# Altium project PCB_BTL.PrjPcb
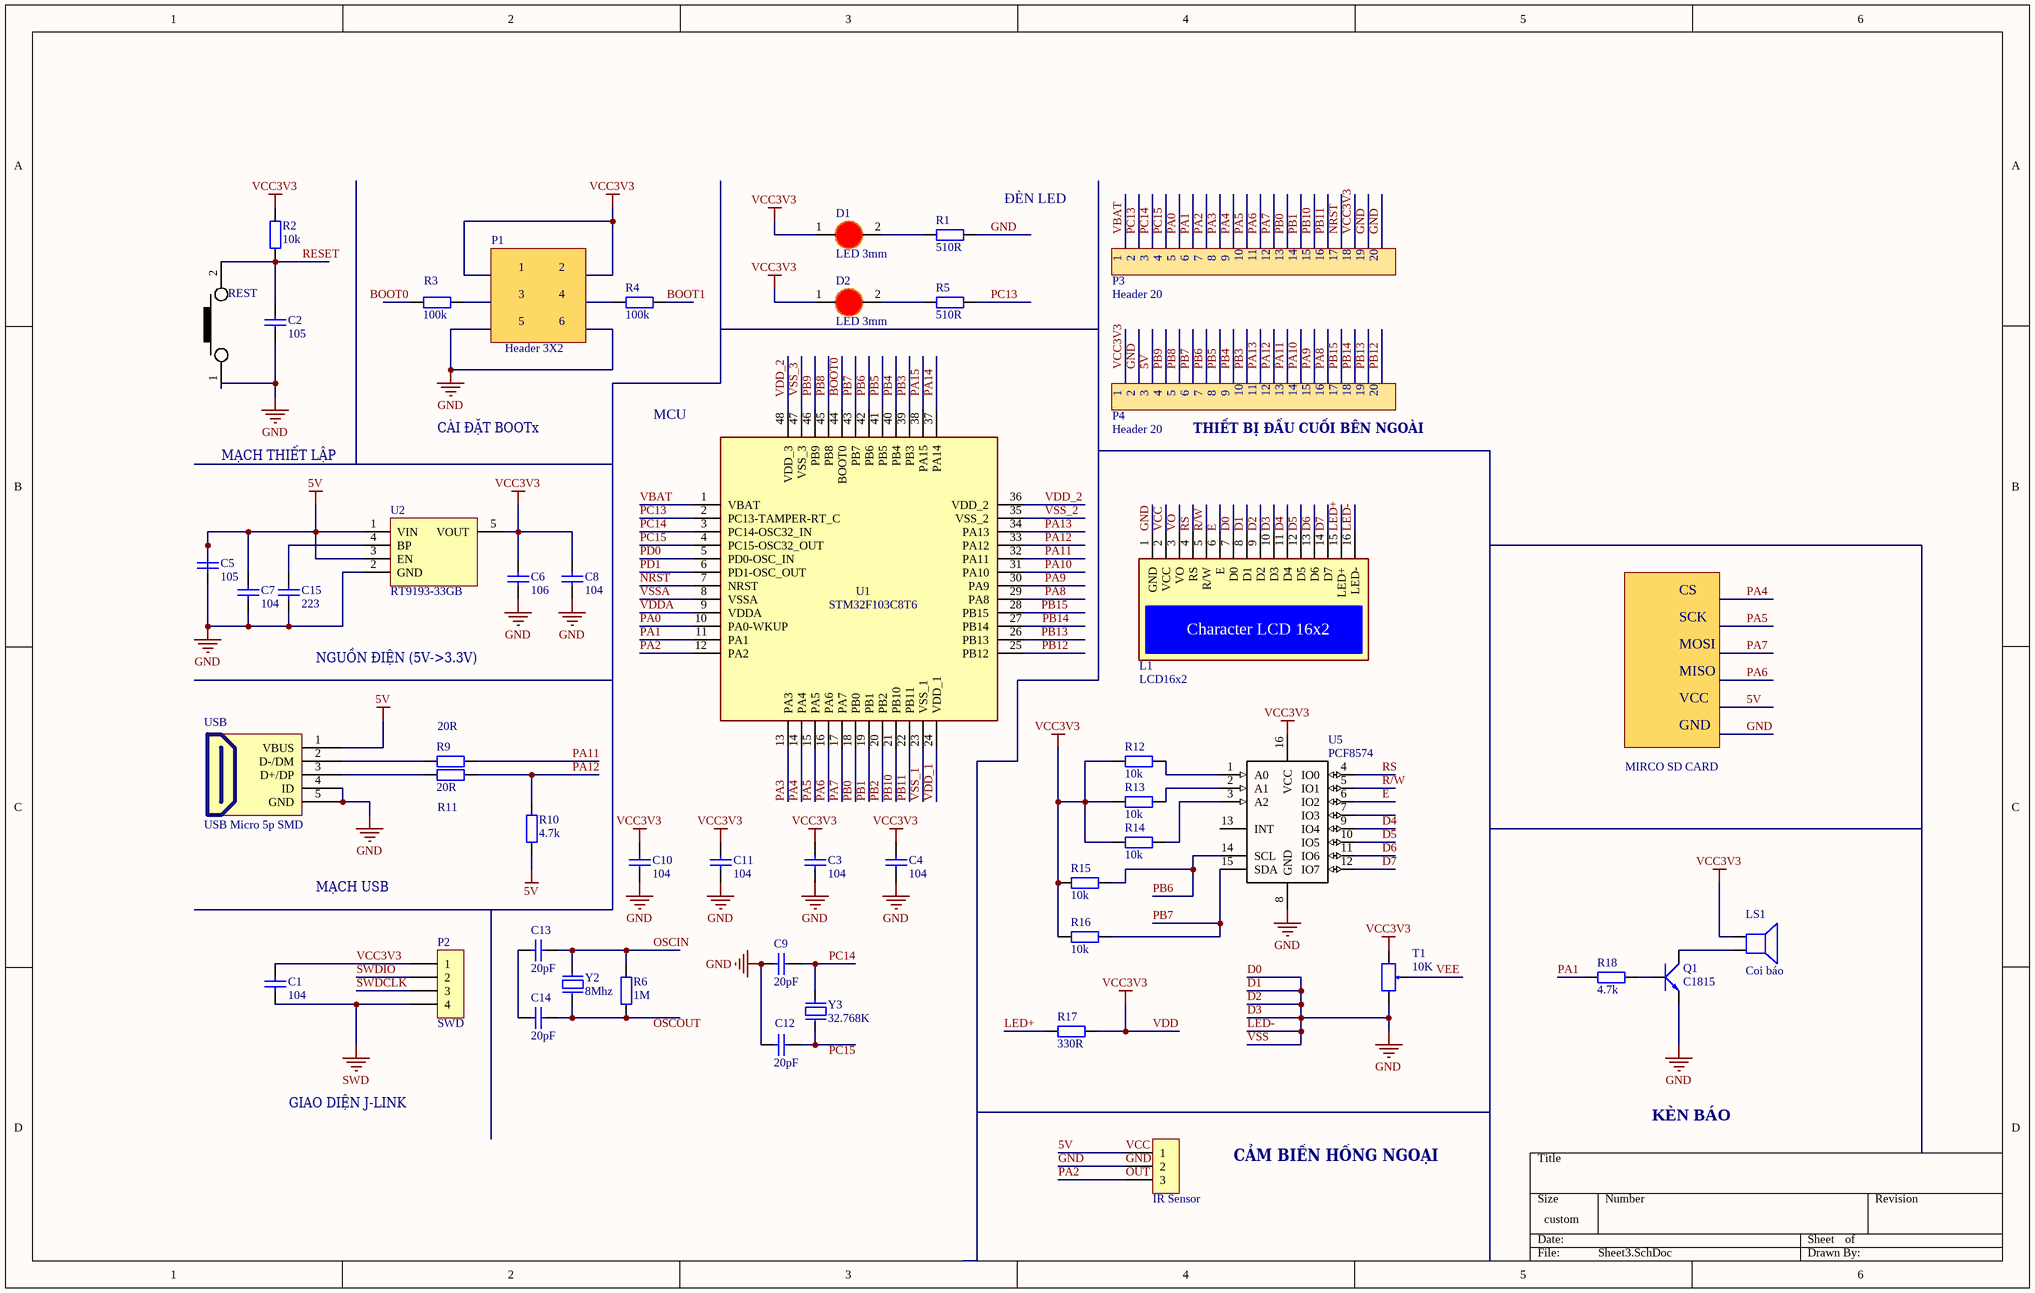
[diagram p0: Sheet3.SchDoc]
1 sheet, 46 parts. Net scope: global (net labels, ports and power ports of the same name join across sheets).
Board file: PCB3.PcbDoc

## Sheet Sheet3.SchDoc
size 381 x 241 mm; SheetNumber: 1; SheetTotal: 1

### Parts
(Parts that share a designator on the sheet are numbered #1, #2 ... from top to bottom, then left to right.)
C1  104  [tu 0603]
C2  105  [tu 0603]
C3  104  [tu 0603]
C4  104  [tu 0603]
C5  105  [tu 0603]
C6  106  [tu 0603]
C7  104  [tu 0603]
C8  104  [tu 0603]
C9  20pF  [tu 0805]
C10  104  [tu 0603]
C11  104  [tu 0603]
C12  20pF  [tu 0805]
C13  20pF  [tu 0805]
C14  20pF  [tu 0805]
C15  223  [tu gom]
D1  LED 3mm  [LED-3MM-RED]
D2  LED 3mm  [LED-3MM-RED]
H?#1  SWD  [XH2.54M-4]
H?#2  IR Sensor  [Header 3P DC 2.54]
L1  LCD16x2  [LCD16X2_3 HOLES]
LS1  Coi báo  [Coi Chip Speacker]
Q1  C1815  [TO92]
R1  510R  [tro vach 1/4w]
R2  10k  [tro vach 1/2w]
R3  100k  [tro vach 1/4w]
R4  100k  [tro vach 1/4w]
R5  510R  [tro vach 1/4w]
R6  1M  [tro vach 1/2w]
R9  20R  [tro vach 1/4w]
R10  4.7k  [tro vach 1/4w]
R11  20R  [tro vach 1/4w]
R12  10k  [tro vach 1/2w]
R13  10k  [tro vach 1/2w]
R14  10k  [tro vach 1/2w]
R15  10k  [tro vach 1/2w]
R16  10k  [tro vach 1/2w]
R17  330R  [tro vach 1/2w]
R18  4.7k  [tro vach 1/2w]
REST  (no value)  [SW_2ARS_TH]
T1  10K  [Bien Tro Vi Chinh Dung]
U1  STM32F103C8T6  [LQFP-48_19.6_393_58X11_SMD]
U2  RT9193-33GB  [SOT23-5]
U5  PCF8574  [DIP16]
USB  USB Micro 5p SMD  [USB Micro 5p SMD]
Y2  8Mhz  [Thach Anh 2 chan SMD5032]
Y3  32.768K  [Thach Anh 2 chan SMD5032]

### Sub-sheets
Header 3X2 = P1 (file not in this document): no entries
Header 20 = P3 (file not in this document): no entries
Header 20 = P4 (file not in this document): no entries
? = MIRCO SD CARD (file not in this document): no entries

### Nets
5V: C5.1 C7.1 H?#2.1 R10.1 U2.1(VIN) U2.3(EN) USB.1(VBUS)  [also labelled VCC]
D0: C2.2 C3.2 C4.2 C5.2 C6.2 C7.2 C8.2 C9.2 C10.2 C11.2 C12.2 C15.2 H?#2.2 Q1.1(E) R1.2 REST.1 T1.3 U2.2(GND) U5.8(GND) USB.4(ID) USB.5(GND)  [also labelled D1, D2, D3, GND, LED-, VSS]
SWD: C1.2 H?#1.4
VCC3V3: C1.1 C3.1 C4.1 C6.1 C8.1 C10.1 C11.1 D1.1(A) D2.1(A) H?#1.1 LS1.1 R2.2 R12.2 R13.2 R14.2 R15.2 R16.2 R17.2 T1.1 U2.5(VOUT) U5.16(VCC)  [also labelled VDD]
BOOT1: R4.2
D4: U5.9(IO4)
D5: U5.10(IO5)
D6: U5.11(IO6)
D7: U5.12(IO7)
E: U5.6(IO2)
LED+: R17.1
OSCIN: C13.1 R6.2 Y2.2
OUT: H?#2.3  [also labelled PA2]
PA1: R18.1
PA11: R9.2
PA12: R10.2 R11.2
PB6: R15.1 U5.14(SCL)
PB7: R16.1 U5.15(SDA)
PC13: R5.2
PC14: C9.1 Y3.2
R/W: U5.5(IO1)
RESET: C2.1 R2.1 REST.2
RS: U5.4(IO0)
SWDCLK: H?#1.3
SWDIO: H?#1.2
VEE: T1.2
NetC12_1: C12.1 Y3.1
NetC13_2: C13.2 C14.2
NetC14_1: C14.1 R6.1 Y2.1
NetC15_1: C15.1 U2.4(BP)
NetD1_2: D1.2(K) R1.1
NetD2_2: D2.2(K) R5.1
NetLS1_2: LS1.2 Q1.2(C)
NetQ1_3: Q1.3(B) R18.2
NetR9_1: R9.1 USB.2(D-/DM)
NetR11_1: R11.1 USB.3(D+/DP)
NetR12_1: R12.1 U5.1(A0)
NetR13_1: R13.1 U5.2(A1)
NetR14_1: R14.1 U5.3(A2)

Not connected (* = marked no-connect by the designer): L1 1(GND) 2(VCC) 3(VO) 4(RS) 5(R/W) 6(E) 7(D0) 8(D1) 9(D2) 10(D3) 11(D4) 12(D5) 13(D6) 14(D7) 15(LED+) 16(LED-); R3 1 2; R4 1; U1 1(VBAT) 2(PC13-TAMPER-RT_C) 3(PC14-OSC32_IN) 4(PC15-OSC32_OUT) 5(PD0-OSC_IN) 6(PD1-OSC_OUT) 7(NRST) 8(VSSA) 9(VDDA) 10(PA0-WKUP) 11(PA1) 12(PA2) 13(PA3) 14(PA4) 15(PA5) 16(PA6) 17(PA7) 18(PB0) 19(PB1) 20(PB2) 21(PB10) 22(PB11) 23(VSS_1) 24(VDD_1) 25(PB12) 26(PB13) 27(PB14) 28(PB15) 29(PA8) 30(PA9) 31(PA10) 32(PA11) 33(PA12) 34(PA13) 35(VSS_2) 36(VDD_2) 37(PA14) 38(PA15) 39(PB3) 40(PB4) 41(PB5) 42(PB6) 43(PB7) 44(BOOT0) 45(PB8) 46(PB9) 47(VSS_3) 48(VDD_3); U5 7(IO3) 13(INT)

### Buses and harness runs
bus BOOT0
bus D0
bus D1
bus D2
bus D3
bus D4
bus D5
bus D6
bus D7
bus E
bus GND
bus LED+
bus LED-
bus NRST
bus PA0
bus PA1
bus PA2
bus PA3
bus PA4
bus PA5
bus PA6
bus PA7
bus PA8
bus PA9
bus PA10
bus PA11
bus PA12
bus PA13
bus PA14
bus PA15
bus PB0
bus PB1
bus PB2
bus PB3
bus PB4
bus PB5
bus PB6
bus PB7
bus PB8
bus PB9
bus PB10
bus PB11
bus PB12
bus PB13
bus PB14
bus PB15
bus PC13
bus PC14
bus PC15
bus PD0
bus PD1
bus R/W
bus RS
bus VBAT
bus VCC
bus VDD_1
bus VDD_2
bus VDDA
bus VO
bus VSS_1
bus VSS_2
bus VSS_3
bus VSSA

### Notes on the sheet
- (near R1) ĐÈN LED
- 1
- 3
- 2
- 4
- 5
- 6
- 7
- 8
- 9
- 10
- 11
- 12
- 13
- 14
- 15
- 16
- 17
- 18
- 19
- 20
- CÀI ĐẶT BOOTx
- (near U1) MCU
- THIẾT BỊ ĐẦU CUỐI BÊN NGOÀI
- MẠCH THIẾT LẬP
- CS
- SCK
- NGUỒN ĐIỆN (5V->3.3V)
- MOSI
- MISO
- VCC
- GND
- MẠCH USB
- (near H?#1) P2
- GIAO DIỆN J-LINK
- CẢM BIẾN HỒNG NGOẠI
- KÈN BÁO
- Labels drawn without touching a wire or pin: BOOT0, OSCOUT, PC15

### Library data of the parts
C1 C3 C4 C7 C8 C10 C11 = Tu 0603 104 50V 10%: Dán; Don_Vi: Con; So_Chan: 2; Ten_Linh_Kien: Tụ 0603 104-100nF 10% 50V; Ma_Hang: MH004568; Chung_Loai: Dán; Kieu_Chan: *
C2 C5 = Tu 0603 105 16V 20%: Dán; Don_Vi: Con; So_Chan: 2; Ten_Linh_Kien: Tụ 0603 105-1uF 20% 16V; Ma_Hang: MH004574; Chung_Loai: Dán; Kieu_Chan: *
C6 = Tu 0603 106 16V 20%: Dán; Don_Vi: Con; So_Chan: 2; Ten_Linh_Kien: Tụ 0603-10uF 20% 16V; Ma_Hang: MH004848; Chung_Loai: Dán; Kieu_Chan: *
C9 C12-C14 = Tu 0805 20pF 50V 10%: Dán; Don_Vi: Con; Ten_Linh_Kien: Tụ 0805 20P 10% 50V; So_Chan: 2; Ma_Hang: MH004558; Chung_Loai: Dán; Kieu_Chan: *
C15 = Tu gom 223 50V: Cắm; Don_Vi: Con; So_Chan: 2; Ten_Linh_Kien: Tụ gốm 223-22nF 50V; Ma_Hang: MH007018; Chung_Loai: Cắm; Kieu_Chan: *
D1 D2 = LED 3mm Do: Cắm; Don_Vi: Con; Ma_Hang: MH003892; Ten_Linh_Kien: Led 3MM Phủ Đỏ (10c); Ghi_Chu: *; Kieu_Chan: *; Chung_Loai: Cắm
H?#1 = Header 4P 2.54 Duc Thang: Cắm; Ten_Linh_Kien: Header 4P XH2.54-4P Đực Thẳng; Don_Vi: Con; Ma_Hang: MH001285; Chung_Loai: Cắm
H?#2 = Header 3P 2.54 Duc Cong: Cắm; Ten_Linh_Kien: Header 3P XH2.54-3P Đực Cong; Don_Vi: Con; Ma_Hang: MH001302; Chung_Loai: Cắm
L1 = LCD16x2: Character LCD 16x2
LS1 = Coi Chip Speaker: Còi chip
Q1 = Trans C1815 DIP: NPN transistor; Value: C9014
R1 R5 = Tro Vach 1/4W 5% 510R: Cắm; So_Chan: 2; Don_Vi: Con; Ten_Linh_Kien: Trở Vạch 1/4w 5% 510R; Ma_Hang: MH007325; Chung_Loai: Cắm; Kieu_Chan: *
R2 R12-R16 = Tro Vach 1/2W 5% 10k: Cắm; Don_Vi: Con; So_Chan: 2; Ten_Linh_Kien: Trở 5% 1/2w 10k; Ma_Hang: MH006206; Chung_Loai: Cắm; Kieu_Chan: *
R3 R4 = Tro Vach 1/4W 5% 100k: Cắm; Don_Vi: Con; So_Chan: 2; Ten_Linh_Kien: Trở Vạch 1/4w 5% 100k; Ma_Hang: MH007352; Chung_Loai: Cắm; Kieu_Chan: *
R6 = Tro Vach 1/2W 5% 1M: Cắm; Don_Vi: Con; So_Chan: 2; Ten_Linh_Kien: Trở 5% 1/2w 1M; Ma_Hang: MH007242; Chung_Loai: Cắm; Kieu_Chan: *
R9 R11 = Tro Vach 1/4W 5% 20R: Cắm; Don_Vi: Con; So_Chan: 2; Ma_Hang: MH007298; Ten_Linh_Kien: Trở Vạch 1/4w 5% 20R; Chung_Loai: Cắm; Kieu_Chan: *
R10 = Tro Vach 1/4W 1% 4.7k: Cắm; Don_Vi: Con; So_Chan: 2; Ten_Linh_Kien: Trở Vạch 1/4w 1% 4.7k; Ma_Hang: MH006350; Chung_Loai: Cắm; Kieu_Chan: *
R17 = Tro Vach 1/2W 5% 330R: Cắm; Don_Vi: Con; So_Chan: 2; Ten_Linh_Kien: Trở 5% 1/2w 330R; Ma_Hang: MH006204; Chung_Loai: Cắm; Kieu_Chan: *
R18 = Tro Vach 1/2W 5% 4.7k: Cắm; Don_Vi: Con; So_Chan: 2; Ten_Linh_Kien: Trở 5% 1/2w 4.7k; Ma_Hang: MH006198; Chung_Loai: Cắm; Kieu_Chan: *
REST = SW1_10A-SRB23A2BBBNN-TH: Rocker Switch SPDT 10A (AC) 125V Panel Mount, Snap-In; Manufacturer: ITT C&K; Alternate Part Number-1: NA; Manufacturer Part Number: SRB23A2BBBNN; Case/Package: TH; Supplier-1: SP ROAD; Supplier Part Number-1: SRB23A2BBBNN
T1 = Bien Tro Tinh Chinh 10K Dung: Cắm; Ma_Hang: MH003232; Ten_Linh_Kien: Biến Trở VR 103-10K 3296W; Don_Vi: Con; Kieu_Chan: *; Chung_Loai: Cắm; Ghi_Chu: *
U1 = IC_STM32F103C8T6: ARM® Cortex®-M3 STM32F1 Microcontroller IC 32-Bit 72MHz 64KB (64K x 8) FLASH 48-LQFP (7x7) /; Manufacturer: STMicroelectronics; Alternate Part Number-1: NA; Manufacturer Part Number: STM32F103C8T6; Case/Package: LQFP48; Supplier-1: LCSC; Supplier Part Number-1: STM32F103C8T6
U2 = REG_5.5V-3.3V-0.3A-1W-SOT-23-5: Linear Voltage Regulator IC 1 Output 300mA SOT-23-5; Manufacturer: Richtek USA Inc.; Alternate Part Number-1: NA; Manufacturer Part Number: RT9193-33GB; Supplier-1: LCSC; Supplier Part Number-1: C15651; Case/Package: SOT-23-5
U5 = PCF8574: I2C PORT EXPANDER; Manufacturer Part Number: PCF8574T/3,512; Manufacturer: NXP Semiconductors; Includes: POR; Interface: I²C; Interrupt Output: Yes; Number of I /O: 8; Voltage - Supply: 2.5 V ~ 6 V; Frequency - Clock: 100KHz; Supplier 1: Digi-Key; Supplier Part Number 1: 568-1076-5-ND; Package / Case: 16-SOIC (7.5mm Width); Category: Integrated Circuits (ICs); Supplier Part Number: 568-1076-5-ND; Operating Temperature: -40°C ~ 85°C; Packaging: Tube; RoHS: RoHS Compliant; Supplier: Digi-Key
USB = USB Micro 5p SMD: USB Type B; Ten: MicroUSB MK5P SMD; Ma_Hang: MH001020
Y2 Y3 = Thach Anh 2 chan SMD 5032: Crystal For all Crystal 2pin.; Value: 4Mhz